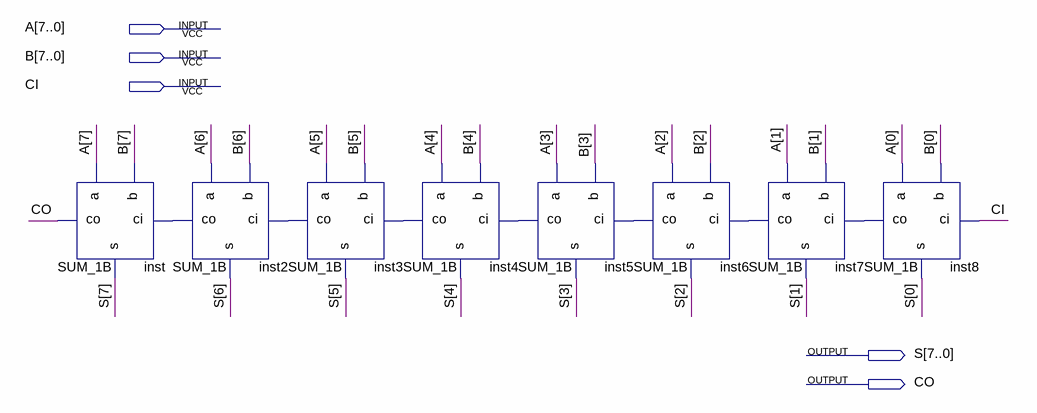
[diagram p0: schematic sheet]
// Quartus schematic SUM_8B.bdf as structural Verilog: 8 symbols, 5 pins
module SUM_8B (
  input  [7:0] A,
  input  [7:0] B,
  input  CI,
  output [7:0] S,
  output CO
);

  wire inst2_co, inst3_co, inst4_co, inst5_co, inst6_co, inst7_co, inst8_co;

  SUM_1B inst (.a(A[7]), .b(B[7]), .ci(inst2_co), .s(S[7]), .co(CO));
  SUM_1B inst2 (.a(A[6]), .b(B[6]), .ci(inst3_co), .s(S[6]), .co(inst2_co));
  SUM_1B inst3 (.a(A[5]), .b(B[5]), .ci(inst4_co), .s(S[5]), .co(inst3_co));
  SUM_1B inst4 (.a(A[4]), .b(B[4]), .ci(inst5_co), .s(S[4]), .co(inst4_co));
  SUM_1B inst5 (.a(A[3]), .b(B[3]), .ci(inst6_co), .s(S[3]), .co(inst5_co));
  SUM_1B inst6 (.a(A[2]), .b(B[2]), .ci(inst7_co), .s(S[2]), .co(inst6_co));
  SUM_1B inst7 (.a(A[1]), .b(B[1]), .ci(inst8_co), .s(S[1]), .co(inst7_co));
  SUM_1B inst8 (.a(A[0]), .b(B[0]), .ci(CI), .s(S[0]), .co(inst8_co));
endmodule
